# EAGLE design 3.3v_regMod_AAT1217 (EAGLE 8.0.0)
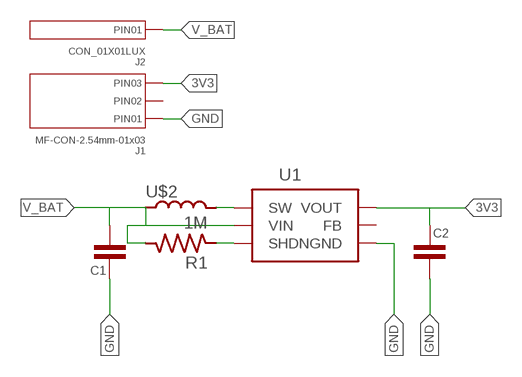
[diagram p0: schematic, sheet 1]

## Parts
C1  CAPACITOR_NP0603-N  [C0603-N]
C2  CAPACITOR_NP0603-N  [C0603-N]
J1  MF-CON-2.54mm-01x03  CON_01X03_PTH_2.54MM  [PTH_2.54MM_01X03]
J2  CON_01X01LUX  [1X01_LUXEON-PAD]
R1  1M  RESISTOR0603-N  [R0603-N]
U1  AAT1217-SOT23-6  [SOT23-6]
U$2  INDUCTOR3030  [L3030]

## Nets
3V3: C2.1 J1.P$3(PIN3) U1.5(VOUT)
GND: C1.1 C2.2 J1.P$1(PIN1) U1.2(GND)
N$1: U1.1(SW) U$2.P$2
N$3: R1.1 U1.4(SHDN)
V_BAT: C1.2 J2.P$1(PIN1) R1.2 U1.6(VIN) U$2.P$1
Unconnected: J1.P$2(PIN2) U1.3(FB)

## Library data of the parts
C1 C2 = My_Passives:CAPACITOR_NP
J1 = My_Connectors:CON_01X03: Library: MF_Connectors Description: Header Connector with 03 Positions and 01 Rows. Use the LABEL Attribute to label the pin on the schematic and PCB. You can remove the attributes on the PCB by using the SMASH function on the part and then deleting the text.; HOUSEPART: YES; MPN: MF-CON-2.54mm-01x03; POPULATE: 1; URL: https://factory.macrofab.com/part/MF-CON-2.54mm-01x03
J2 = My_Connectors:CON_01X01: Library: MF_Connectors Description: Header Connector with 01 Positions and 01 Rows. Use the LABEL Attribute to label the pin on the schematic and PCB. You can remove the attributes on the PCB by using the SMASH function on the part and then deleting the text.
R1 = My_Passives:RESISTOR
U1 = My_IC_Power:AAT1217; PARTNO: AAT1217ICA-3.3-T1
U$2 = My_Passives:INDUCTOR

## Board
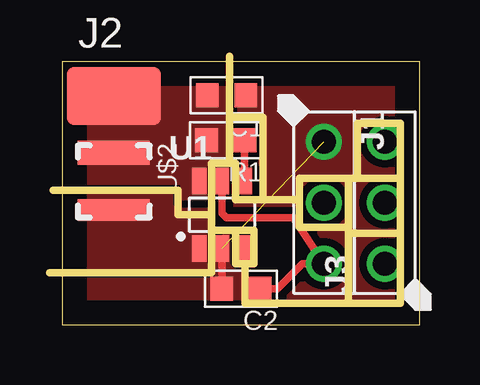
[diagram p1: board, top side]

Size 14.91 x 10.94 mm. Coordinates in mm from the lower left corner, seen from the top.
Outline: 0,0 14.91,0 14.91,10.94 0,10.94 0,0
Copper layers (1*16): Top 0.035mm / dielectric 1.5mm / Bottom 0.035mm
Design rules "default": minimum track width 10mil, minimum drill 24mil, track to track 8mil, track to pad 8mil, pad to pad 8mil, via to via 8mil, smd to smd 8mil, copper to edge 40mil, drill to drill 8mil, minimum pad ring 10mil, minimum via ring 8mil, stop-mask expansion 4mil, vias tented up to drill 0mil, thermal gap 10mil
Milling: 40 lines

### Footprints (pad centres in the part's own frame; a part is rotated, then mirrored left to right if it is on the bottom)
C0603-N = smd 0.95 x 1: 1 -0.8,0; 2 0.8,0
PTH_2.54MM_01X03 = drill 1: P$1 -2.54,0; P$2 0,0; P$3 2.54,0
1X01_LUXEON-PAD = smd 3.9 x 2.4: P$1 0,0
R0603-N = smd 0.95 x 1: 1 -0.8,0; 2 0.8,0
SOT23-6 = smd 0.6 x 1.1: 1 0,0; 2 0.95,0; 3 1.9,0; 4 1.9,2.8; 5 0.95,2.8; 6 0,2.8
L3030 = smd 1 x 3: P$1 -1.2,0 | smd 0.9 x 3: P$2 1.2,0

### Placement (x,y rotation side)
C1  6.86,9.56 180 top
C2  7.46,1.49 180 top
J1  10.92,5.08 270 top
J2  2.16,9.53 0 top
J3  MF-CON-2.54mm-01x03  [PTH_2.54MM_01X03]  13.46,5.08 90 top
R1  6.83,7.68 180 top
U1  5.71,3.17 0 top
U$2  2.16,5.97 270 top

### Tracks (layer width: path | path; a pad name or v marks a point on that pad's centre or on a via)
3V3
  Top 0.305: U1.5 6.67,4.64 6.86,4.45 9.65,4.45 J1.P$3 10.03,2.54 8.98,1.49 C2.1
GND  (1 unrouted)
  Top 0.305: U1.2 C2.2
  pour Top (isolate 0.305, rank 6, no thermals): 0,0 14.86,0 14.86,10.92 0,10.92
N$1
  pour Top (isolate 0.305, rank 2, no thermals): 0,5.71 4.83,5.71 6.22,5.71 6.22,2.41 0,2.41
N$3
  Top 0.305: U1.4 7.62,7.67 R1.1
V_BAT
  pour Top (isolate 0.305, no thermals): 0,10.92 0,5.97 5.08,5.97 5.08,5.33 6.1,5.33 6.1,6.73 6.86,6.73 6.86,10.92